# EasyEDA Pro project ProDoc_PCB1_5_2026-05-18.epro

# Board PCB1_5
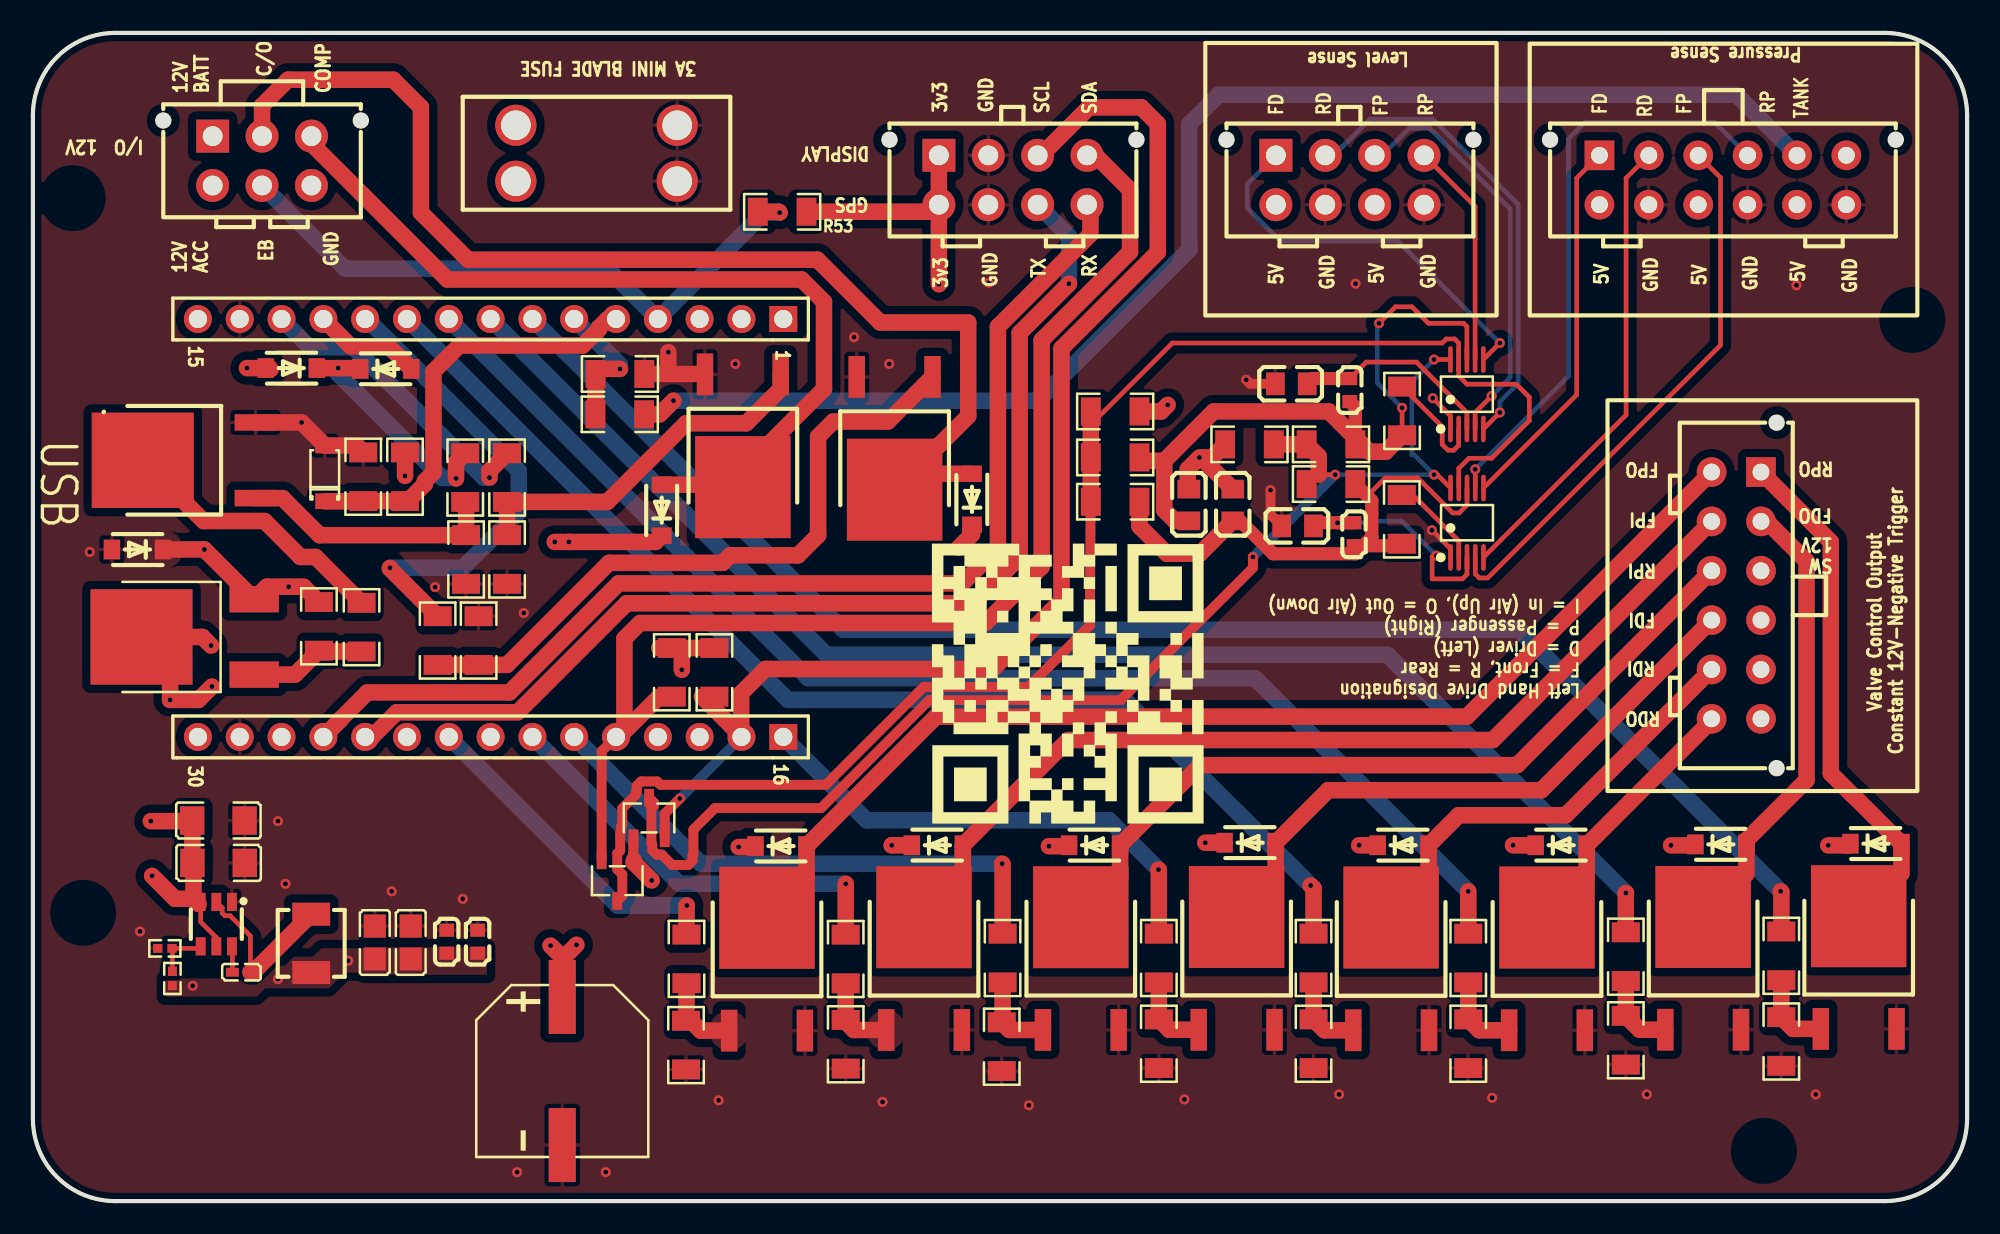
[diagram p0: board, top side]
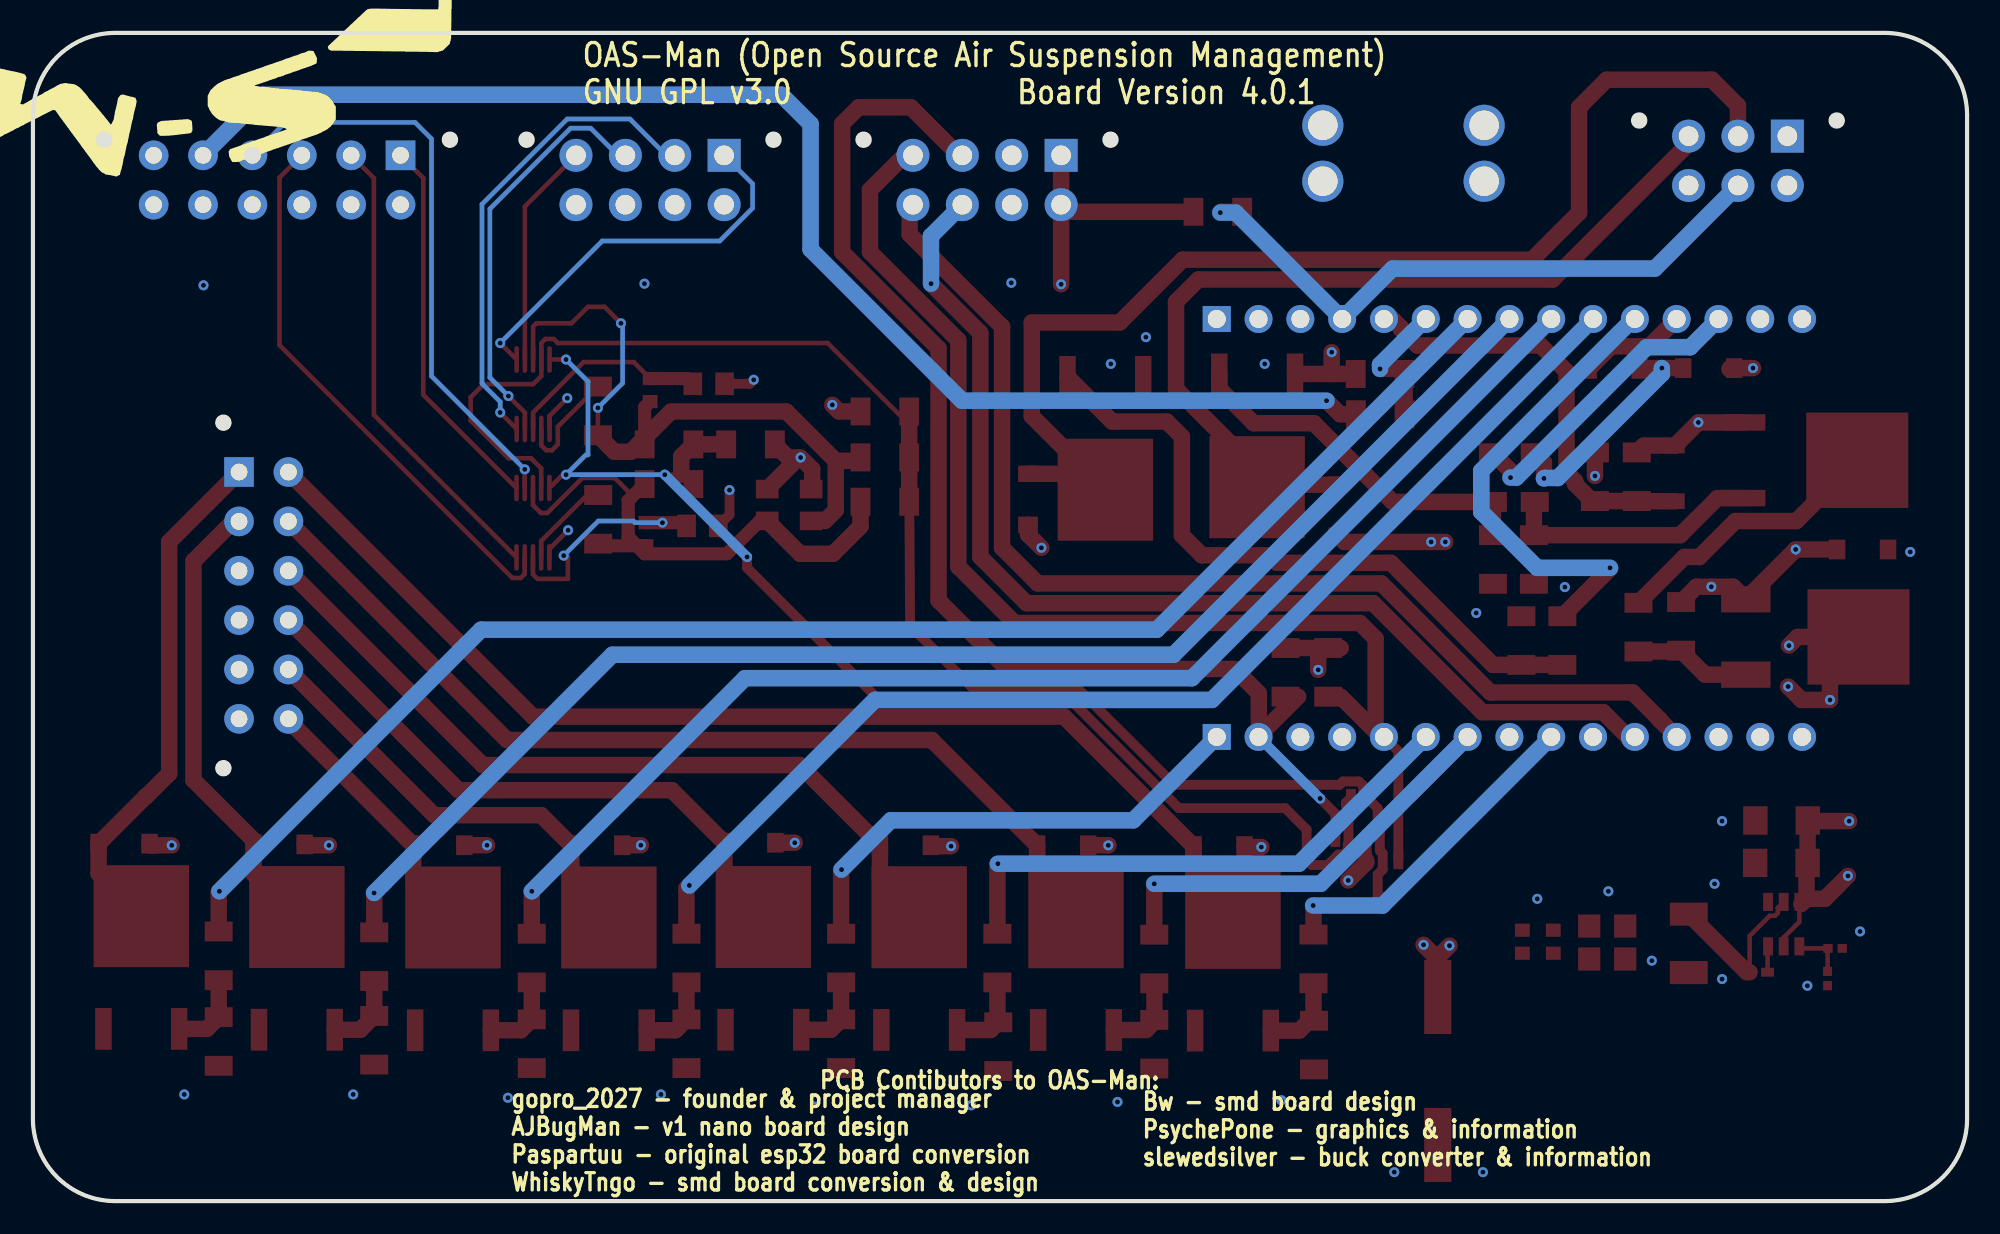
[diagram p1: board, bottom side, seen from below]

Outline 117.5 x 71 mm; copper layers: Top Layer, Inner1, Inner2, Bottom Layer. Coordinates in mm from the lower left corner of the outline.
Outline path: 0,66 0,5 arc(1.46,1.46) 5,0 112.5,0 arc(116.04,1.46) 117.5,5 117.5,66 arc(116.04,69.54) 112.5,71 5,71 arc(1.46,69.54) 0,66
Stack: Top Layer 0.035mm Outer layer thickness 1oz / Dielectric1 0.2104mm 7628 RC49% 8.6mil / Inner1 0.0152mm Inner layer thickness / Dielectric2 1.065mm 1.1mm H/HOZ Copper / Inner2 0.0152mm Inner layer thickness / Dielectric3 0.2104mm 7628 RC49% 8.6mil / Bottom Layer 0.035mm Outer layer thickness 1oz

## Design rules (mm)
template: Custom Config
spacing copperThickness1oz: track to track 0.102, other pairs 0.152 to 0.3
spacing copperThickness2oz (default): track to track 0.203, other pairs 0.152 to 0.3
track width copperThickness1oz (default): min 0.127, default 1, max 2.54
track width copperThickness2oz: min 0.203, default 0.254, max 2.54
differential pair differentialPair (default): width min 0.127, default 0.254, max 2.54; gap min 0.152, default 0.152
via viaSize (default): diameter min 0.5, default 0.61, max 10; hole min 0.3, default 0.305, max 6.3
net $1N33547 uses Fullfill
pour e746 uses Fullfill
pour e1012 uses Fullfill

## Placement (name value [footprint] x y rotation side)
C1  1uF  [C0603]  80 49.29 90 top
C2  1uF  [C0603]  80.26 40.53 90 top
C5  1uF  [C0603]  25.14 15.77 270 top
C6  1uF  [C0603]  27.02 15.77 270 top
C12  100nF  [C0402]  12.67 13.91 0 top
C13  22uF  [C0805]  22.95 15.71 270 top
C14  22uF  [C0805]  20.77 15.71 270 top
C15  10uF  [C1206]  11.27 23.13 180 top
C16  10uF  [C1206]  11.28 20.55 180 top
C17  1000uF  [CAP-SMD_BD10.0-L10.3-W10.3-FD]  32.16 7.91 270 top
CN2  HC-MX3.0-2*6A  [CONN-TH_12P-P3.00_HC-MX3.0-2X6A]  103.48 36.81 270 top
CN3  HC-MX3.0-2*6A  [CONN-TH_12P-P3.00_HC-MX3.0-2X6A]  102.67 62.06 0 top
CN4  HC-MX3.0-2*4A  [CONN-TH_8P-P3.00_HC-MX3.0-2X4A]  80.01 62.06 0 top
CN5  HC-MX3.0-2*4A  [CONN-TH_8P-P3.00_HC-MX3.0-2X4A]  59.54 62.06 0 top
CN7  HC-MX3.0-2*3A  [CONN-TH_6P-P3.00_HC-MX3.0-2X3A]  13.92 63.23 0 top
D1  SM4007PL  [SOD-123F_L2.8-W1.8-LS3.7-RD]  54.94 21.63 0 top
D2  SM4007PL  [SOD-123F_L2.8-W1.8-LS3.7-RD]  45.44 21.58 0 top
D3  SM4007PL  [SOD-123F_L2.8-W1.8-LS3.7-RD]  73.94 21.78 0 top
D4  SM4007PL  [SOD-123F_L2.8-W1.8-LS3.7-RD]  102.54 21.68 0 top
D5  SM4007PL  [SOD-123F_L2.8-W1.8-LS3.7-RD]  92.84 21.63 0 top
D6  SM4007PL  [SOD-123F_L2.8-W1.8-LS3.7-RD]  83.24 21.63 0 top
D7  SM4007PL  [SOD-123F_L2.8-W1.8-LS3.7-RD]  111.96 21.72 0 top
D8  SM4007PL  [SOD-123F_L2.8-W1.8-LS3.7-RD]  64.5 21.63 0 top
D9  SM4007PL  [SOD-123F_L2.8-W1.8-LS3.7-RD]  38.2 41.99 90 top
D10  SM4007PL  [SOD-123F_L2.8-W1.8-LS3.7-RD]  6.35 39.61 180 top
D15  SM4007PL  [SOD-123F_L2.8-W1.8-LS3.7-RD]  15.7 50.63 180 top
D16  SM4007PL  [SOD-123F_L2.8-W1.8-LS3.7-RD]  21.44 50.58 0 top
D17  SM4007PL  [SOD-123F_L2.8-W1.8-LS3.7-RD]  57.05 42.65 90 top
F2  XF-508P-B-B  [FUSE-TH_4P-L16.0-W6.7]  34.24 63.68 0 top
L3  3.3uH  [IND-SMD_L4.5-W4.1_SL0420]  16.91 15.66 270 top
Q1  MDT30N06L  [TO-252-2_L6.6-W5.6-P4.60-LS9.7-BR]  54.13 13.83 270 top
Q2  MDT30N06L  [TO-252-2_L6.6-W5.6-P4.60-LS9.7-BR]  44.6 13.79 270 top
Q3  MDT30N06L  [TO-252-2_L6.6-W5.6-P4.60-LS9.7-BR]  73.12 13.84 270 top
Q4  MDT30N06L  [TO-252-2_L6.6-W5.6-P4.60-LS9.7-BR]  101.47 13.84 270 top
Q5  MDT30N06L  [TO-252-2_L6.6-W5.6-P4.60-LS9.7-BR]  91.98 13.81 270 top
Q6  MDT30N06L  [TO-252-2_L6.6-W5.6-P4.60-LS9.7-BR]  82.51 13.81 270 top
Q7  MDT30N06L  [TO-252-2_L6.6-W5.6-P4.60-LS9.7-BR]  110.91 13.89 270 top
Q8  MDT30N06L  [TO-252-2_L6.6-W5.6-P4.60-LS9.7-BR]  63.66 13.83 270 top
Q9  MDT30N06L  [TO-252-2_L6.6-W5.6-P4.60-LS9.7-BR]  43.13 46.82 90 top
Q12  BSS138  [SOT-23-3_L2.9-W1.6-P1.90-LS2.8-BR]  35.5 19.47 90 top
Q13  BSS138  [SOT-23-3_L2.9-W1.6-P1.90-LS2.8-BR]  37.43 23.28 270 top
Q14  MDT30N06L  [TO-252-2_L6.6-W5.6-P4.60-LS9.7-BR]  10.1 45.03 0 top
Q15  MDT35P10D  [TO-252-2_L6.6-W6.1-P4.57-LS9.9-BR-CW]  10.02 34.29 0 top
Q16  MDT30N06L  [TO-252-2_L6.6-W5.6-P4.60-LS9.7-BR]  52.35 46.66 90 top
R1  10kΩ  [R1206]  49.38 9.53 270 top
R2  10kΩ  [R1206]  39.68 9.48 270 top
R3  10kΩ  [R1206]  68.4 9.56 270 top
R4  10kΩ  [R1206]  96.77 9.78 270 top
R5  10kΩ  [R1206]  87.2 9.56 270 top
R6  10kΩ  [R1206]  77.8 9.56 270 top
R7  10kΩ  [R1206]  106.22 9.7 270 top
R8  10kΩ  [R1206]  58.86 9.39 270 top
R9  150Ω  [R1206]  49.38 14.71 90 top
R10  150Ω  [R1206]  39.7 14.72 90 top
R11  150Ω  [R1206]  68.4 14.77 90 top
R12  150Ω  [R1206]  96.77 14.86 90 top
R13  150Ω  [R1206]  87.2 14.77 90 top
R14  150Ω  [R1206]  77.8 14.77 90 top
R15  150Ω  [R1206]  106.22 14.91 90 top
R16  150Ω  [R1206]  58.91 14.77 90 top
R17  150Ω  [R1206]  28.8 43.97 90 top
R18  10kΩ  [R1206]  28.8 39 270 top
R19  1kΩ  [R1206]  35.65 47.82 0 top
R23  10kΩ  [R1206]  22.61 44.03 90 top
R24  2kΩ  [R1206]  35.66 50.27 180 top
R25  10kΩ  [R1206]  20.07 44.03 270 top
R27  10kΩ  [R1206]  65.75 47.99 180 top
R28  10kΩ  [R1206]  41.4 32.14 90 top
R29  10kΩ  [R1206]  73.91 45.99 180 top
R30  10kΩ  [R1206]  38.81 32.14 90 top
R33  1MΩ  [R1206]  78.86 45.99 180 top
R37  10kΩ  [R1206]  26.31 39 270 top
R38  150Ω  [R1206]  26.26 43.97 90 top
R39  10kΩ  [R1206]  17.37 34.93 270 top
R40  3kΩ  [R1206]  19.96 34.88 270 top
R41  1MΩ  [R1206]  83.18 48.02 90 top
R42  1MΩ  [R1206]  65.75 45.2 180 top
R43  1MΩ  [R1206]  83.16 41.43 90 top
R44  1MΩ  [R1206]  65.75 42.51 0 top
R45  1MΩ  [R1206]  78.86 43.58 0 top
R50  56.2kΩ  [R0402]  8.47 13.53 270 top
R51  10kΩ  [R0402]  8.02 15.36 0 top
R53  10kΩ  [R1206]  45.52 60.13 180 top
R54  10kΩ  [R1206]  27.08 34.07 90 top
R55  150Ω  [R1206]  24.59 34.07 90 top
U4  ADS1115IDGSR  [MSOP-10_L3.0-W3.0-P0.50-LS5.0-BL]  87.11 49.04 0 top
U5  ADS1115IDGSR  [MSOP-10_L3.0-W3.0-P0.50-LS5.0-BL]  87.12 41.23 0 top
U7  PM2.54-1*15  [HDR-TH_15P-P2.54-V-F]  27.8 53.61 180 top
U8  PM2.54-1*15  [HDR-TH_15P-P2.54-V-F]  27.8 28.21 180 top
U9  GZ2012D152TF  [L0805]  70.22 42.31 270 top
U10  GZ2012D152TF  [L0805]  76.45 49.67 0 top
U11  GZ2012D152TF  [L0805]  72.89 42.31 270 top
U12  GZ2012D152TF  [L0805]  76.83 41.04 0 top
U13  TPS563200DDCR  [SOT-23-6_L2.9-W1.6-P0.95-LS2.8-BR]  11.14 16.83 90 top
ZD1  MMSZ4684  [SOD-123_L2.8-W1.8-LS3.7-RD]  17.73 44.23 90 top

## Footprints (pads in the part's own frame, mm; a bottom-side part is the same pattern mirrored in y, then rotated)
C0402
  rect 0.79x0.54 smd: 1(-0.545,0) 2(0.545,0)
C0603
  rect 0.8x0.9 smd: 1(-0.7,0) 2(0.7,0)
C0805
  rect 1.41x1.35 smd: 1(-1,0) 2(1,0)
C1206
  rect 1.485x1.728 smd: 1(-1.593,0) 2(1.593,0)
CAP-SMD_BD10.0-L10.3-W10.3-FD
  rect 4.5x1.65 smd: 1(-4.5,0) 2(4.5,0)
CONN-TH_6P-P3.00_HC-MX3.0-2X3A
  rect 2x2 hole 1.2: 1(-3,1.5)
  round 2 hole 1.2: 2(-3,-1.5) 3(0,1.5) 4(0,-1.5) 5(3,1.5) 6(3,-1.5)
CONN-TH_8P-P3.00_HC-MX3.0-2X4A
  rect 2x2 hole 1.2: 1(-4.5,1.5)
  round 2 hole 1.2: 2(-4.5,-1.5) 3(-1.5,1.5) 4(-1.5,-1.5) 5(1.5,1.5) 6(1.5,-1.5) 7(4.5,1.5) 8(4.5,-1.5)
CONN-TH_12P-P3.00_HC-MX3.0-2X6A
  rect 1.8x1.8 hole 1.02: 1(-7.5,1.5)
  round 1.8 hole 1.02: 2(-7.5,-1.5) 3(-4.5,1.5) 4(-4.5,-1.5) 5(-1.5,1.5) 6(-1.5,-1.5) 7(1.5,1.5) 8(1.5,-1.5) 9(4.5,1.5) 10(4.5,-1.5) 11(7.5,1.5) 12(7.5,-1.5)
FUSE-TH_4P-L16.0-W6.7
  round 2.5 hole 1.8: 1(-4.9,1.7) 2(4.9,1.7) 3(4.9,-1.7) 4(-4.9,-1.7)
HDR-TH_15P-P2.54-V-F
  rect 1.7x1.575 hole 1.1: 1(-17.78,0)
  round 1.7 hole 1.1: 2(-15.24,0) 3(-12.7,0) 4(-10.16,0) 5(-7.62,0) 6(-5.08,0) 7(-2.54,0) 8(0,0) 9(2.54,0) 10(5.08,0) 11(7.62,0) 12(10.16,0) 13(12.7,0) 14(15.24,0) 15(17.78,0)
IND-SMD_L4.5-W4.1_SL0420
  rect 1.4x2.3 smd: 1(-1.775,0) 2(1.775,0)
L0805
  rect 1.133x1.377 smd: 1(-0.966,0) 2(0.966,0)
MSOP-10_L3.0-W3.0-P0.50-LS5.0-BL
  oval 0.28x1.62 smd: 1(-1,-2.11) 2(-0.5,-2.11) 3(0,-2.11) 4(0.5,-2.11) 5(1,-2.11) 6(1,2.11) 7(0.5,2.11) 8(0,2.11) 9(-0.5,2.11) 10(-1,2.11)
R0402
  rect 0.566x0.54 smd: 1(-0.433,0) 2(0.433,0)
R1206
  rect 1.208x1.701 smd: 1(-1.479,0) 2(1.479,0)
SOD-123_L2.8-W1.8-LS3.7-RD
  rect 0.95x1.15 smd: 1(-1.692,0) 2(1.692,0)
SOD-123F_L2.8-W1.8-LS3.7-RD
  rect 1x1.2 smd: 1(-1.55,0) 2(1.55,0)
SOT-23-3_L2.9-W1.6-P1.90-LS2.8-BR
  rect 1.07x0.6 smd: 1(1.235,-0.95) 2(1.235,0.95) 3(-1.235,0)
SOT-23-6_L2.9-W1.6-P0.95-LS2.8-BR
  rect 1.1x0.6 smd: 1(1.35,-0.95) 2(1.35,0) 3(1.35,0.95) 4(-1.35,0.95) 5(-1.35,0) 6(-1.35,-0.95)
TO-252-2_L6.6-W5.6-P4.60-LS9.7-BR
  rect 2.54x1 smd: 1(3.426,-2.3) 3(3.426,2.3)
  rect 6.2x5.8 smd: 2(-3.426,0)
TO-252-2_L6.6-W6.1-P4.57-LS9.9-BR-CW
  rect 3x1.6 smd: 1(3.424,-2.29) 3(3.424,2.29)
  rect 6.2x5.8 smd: 2(-3.424,0)

## Nets
3.3V: CN5.1 CN5.2 Q12.1 Q13.1 R28.2 R30.2 R53.1 U8.15
12VACC: CN7.2 D15.2 R23.2
12VS: C15.2 C16.2 CN2.5 Q15.2 U13.3 U13.5
+5V: C5.2 C6.2 C13.2 C14.2 CN3.2 CN3.6 CN3.10 CN4.2 CN4.6 L3.2 R27.1 R29.2 R50.2 U4.1 U7.15 U9.1 U11.1
GND: C5.1 C6.1 C13.1 C14.1 C15.1 C16.1 C17.2 CN3.4 CN3.8 CN3.12 CN4.4 CN4.8 CN5.3 CN5.4 D10.2 F2.2 F2.3 Q1.3 Q2.3 Q3.3 Q4.3 Q5.3 Q6.3 Q7.3 Q8.3 Q9.3 Q14.3 Q16.3 R1.2 R2.2 R3.2 R4.2 R5.2 R6.2 R7.2 R8.2 R18.2 R24.1 R25.1 R37.2 R51.1 R54.2 U5.1 U7.14 U8.14 U10.1 U12.1 U13.1 ZD1.2
VCC: C17.1 CN7.1 D1.1 D2.1 D3.1 D4.1 D5.1 D6.1 D7.1 D8.1 D9.1 D10.1 D17.1 Q15.3 R39.1
ACC_SENSE: R23.1 R25.2 U7.5 ZD1.1
ADS/LLC_1: Q13.3 R29.1 R33.2 R45.1 U4.10 U5.10
ADS/LLC_2: Q12.3 R27.2 R42.2 R44.1 U4.9 U5.9
COMP_OUTPUT: CN7.5 D9.2 Q9.2
COMP_OUTPUT_TRIGGER: R17.2 U7.13
CUSTOM_OUTPUT: CN7.3 D17.2 Q16.2
CUSTOM_OUTPUT_TRIGGER: R55.2 U7.11
E-BRAKE: CN7.4 R53.2 U7.4
FD_LEVEL2: CN4.1 U4.6
FD_PRESS1: CN3.1 U5.6
FDI: CN2.8 D3.2 Q3.2
FDI_TRIGGER: R11.2 U8.1
FDO: CN2.3 D4.2 Q4.2
FDO_TRIGGER: R12.2 U7.8
FP_LEVEL2: CN4.5 U4.4
FP_PRESS1: CN3.5 U5.4
FPI: CN2.4 D1.2 Q1.2
FPI_TRIGGER: R9.2 U8.7
FPO: CN2.2 D2.2 Q2.2
FPO_TRIGGER: R10.2 U8.9
KEEP_ALIVE: D16.2 U7.12
RD_LEVEL2: CN4.3 U4.5
RD_PRESS1: CN3.3 U5.5
RDI: CN2.10 D6.2 Q6.2
RDI_TRIGGER: R14.2 U7.10
RDO: CN2.12 D5.2 Q5.2
RDO_TRIGGER: R13.2 U7.9
RP_LEVEL2: CN4.7 U4.7
RP_PRESS1: CN3.7 U5.7
RPI: CN2.6 D8.2 Q8.2
RPI_TRIGGER: R16.2 U8.6
RPO: CN2.1 D7.2 Q7.2
RPO_TRIGGER: R15.2 U7.7
RX: CN5.8 U8.12
SCL: CN5.5 Q13.2 R28.1 U8.2
SDA: CN5.7 Q12.2 R30.1 U8.5
TANK_PRESS1: CN3.9 R19.2
TANKPRESSURESIG: R19.1 R24.2 U7.6
TX: CN5.6 U8.11
VEHICLE_GND: CN7.6 F2.1 F2.4
$1N4350: Q8.1 R8.1 R16.1
$1N4351: Q7.1 R7.1 R15.1
$1N4352: Q6.1 R6.1 R14.1
$1N4353: Q5.1 R5.1 R13.1
$1N4354: Q4.1 R4.1 R12.1
$1N4355: Q3.1 R3.1 R11.1
$1N4356: Q2.1 R2.1 R10.1
$1N4357: Q1.1 R1.1 R9.1
$1N4376: Q9.1 R17.1 R18.1
$1N4402: C2.1 R43.1 R44.2 R45.2 U5.8 U11.2
$1N4419: C1.1 R33.1 R41.1 R42.1 U4.8 U9.2
$1N4475: Q14.2 R40.1
$1N4476: Q15.1 R39.2 R40.2
$1N4478: Q14.1 R37.1 R38.1
$1N12707: C1.2 U4.3 U10.2
$1N12784: R41.2 U4.2
$1N13030: C2.2 U5.3 U12.2
$1N13089: R43.2 U5.2
$1N23795: D15.1 D16.1 R38.2
$1N33541: C12.1 U13.6
$1N33542: C12.2 L3.1 U13.2
$1N33547: R50.1 R51.2 U13.4
$1N131280: Q16.1 R54.1 R55.1

Pads without a net: CN2 7 9 11; CN3 11; U7 1 2 3; U8 3 4 8 10 13

## Via types
v1: diameter 0.61, hole 0.305, Top Layer to Bottom Layer, 89 vias

## Routing (per net, layer and track width the routed paths; a pad name or vN(x,y) marks a point on that pad's centre or on a via; arc(x,y) is an arc through that point)
3.3V: length 111.7
  Top Layer w0.6: 36.48,20.74 Q12.1 ; Q13.1 36.48,20.74
  Top Layer w1: v1(39.42,32.29) 39.42,33.55 39.36,33.62 ; CN5.1 CN5.2 ; CN5.2 v1(55.04,55.72) ; CN5.2 54.61,60.13 R53.1 ; 39.36,33.62 38.05,33.62 ; 39.36,33.62 40.64,33.62 ; v1(37.59,19.49) 36.5,20.58 36.5,20.71
  Inner2 w1: v1(39.42,32.29) 37.54,30.41 12.22,30.41 U8.15 ; v1(39.42,32.29) 55.04,47.91 v1(55.04,55.72) ; v1(39.42,32.29) 40.23,31.48 46.94,31.48 48.77,29.65 48.77,26.5 45.67,23.4 41.5,23.4 v1(37.59,19.49)
12VACC: length 34.1
  Top Layer w1: v1(13,50.63) 14.38,50.63 14.44,50.56 ; v1(22.61,44.08) R23.2
  Inner1 w1: CN7.2 7.47,58.28 7.47,52.25 9.09,50.63 v1(13,50.63) 14.94,48.7 21.03,48.7 22.61,47.12 v1(22.61,44.08)
12VS: length 25.8
  Top Layer w0.28: U13.3 10.19,16.97 11.14,16.02 U13.5
  Top Layer w1: v1(7.16,23.09) 9.64,23.09 C15.2 9.69,23.12 C16.2 9.75,20.49 9.75,18.37 ; 9.75,18.37 10.07,18.06 ; 9.75,18.37 8.64,18.37 v1(7.24,19.77) ; v1(10.87,31.27) 10.06,30.46 v1(8.33,30.46) 8.33,32.55 Q15.2 10.3,34.29 v1(10.82,33.76)
+5V: length 227.2
  Top Layer w0.28: U4.1 86.11,47.72 v1(85.04,48.8)
  Top Layer w1: v1(70.87,45.19) 70.16,44.49 70.16,43.34 U9.1 ; 67.22,47.99 68.53,47.99 v1(68.94,48.39) ; U11.1 70.97,45.19 71.63,45.19 R29.2
  Inner2 w0.6: v1(85.04,48.8) 84.53,49.31 83.09,49.31 74.55,57.84
  Inner2 w1: v1(9.7,13.09) 8.29,14.5 8.29,20.29 ; CN3.10 104.91,58.3 103.43,58.3 CN3.6 99.01,58.4 97.32,58.4 CN3.2 ; 13.97,14.61 13.97,14.41 v1(14.88,13.49) ; 13.97,14.61 v1(19.15,14.61) ; 13.97,14.61 8.29,20.29 ; CN4.6 79.14,58.19 77.88,58.19 CN4.2 ; 8.29,20.29 1.88,26.7 1.88,50.58 4.91,53.61 U7.15
  Inner2 w1.5: 59.43,57.84 14.25,57.84 U7.15 ; 59.43,57.84 59.43,57.57 68.6,48.39 v1(68.94,48.39) 70.87,46.46 v1(70.87,45.19) ; 59.43,57.84 104.24,57.84
GND: length 62.1
  Top Layer w0.28: v1(84.99,40.77) 86.12,39.64 U5.1
  Top Layer w0.6: v1(73.71,49.92) 73.95,49.67 U10.1 ; v1(75.18,43.21) 75.18,41.72 U12.1
  Top Layer w1: Q14.3 v1(16.32,47.33) ZD1.2 19.65,45.92 R25.1 ; 38.6,50.27 40.74,50.27 40.77,50.25 40.83,50.25 ; 38.6,50.27 R24.1 ; 38.6,50.27 v1(38.6,51.59)
  Inner1 w1: v1(58.06,55.81) 58.04,55.84 CN5.4 CN5.3 ; CN4.8 84.51,59.92 v1(80.35,55.76) 80.16,55.76 78.51,57.41 CN4.4 ; CN3.8 104.17,58.63 ; 104.17,58.63 104.17,58.19 101.84,55.86 100.84,55.86 98.17,58.53 CN3.4 ; 104.17,58.63 v1(107.14,55.66) 108.14,55.66 110.17,57.69 CN3.12
  vias: v1(3.45,39.45) v1(6.5,16.39) v1(14.88,23.09) v1(15.34,19.28) v1(21.79,18.83) v1(24.44,37.32) v1(26.11,18.37) v1(29.41,1.76) v1(29.82,35.74) v1(34.8,1.76) v1(41.66,6.13) v1(42.67,50.88) v1(49.89,52.51) v1(51.61,6.03) v1(52.02,50.88) v1(60.5,5.82) v1(69.95,6.18) v1(79.35,6.48) v1(88.65,6.28) v1(98.04,6.48) v1(108.31,6.48)
VCC: length 100.9
  Top Layer w1: 32.16,14.71 v1(33.02,15.58) ; 32.16,14.71 32.16,14.81 v1(31.44,15.53) ; 32.16,14.71 C17.1 ; v1(31.7,40.06) v1(32.56,40.06) 37.82,40.06 D9.1 ; v1(109.07,21.62) 110.31,21.62 110.41,21.72 ; D4.1 100.94,21.62 v1(99.52,21.62) ; v1(42.88,21.52) 43.84,21.52 43.9,21.58 ; D5.1 v1(89.92,21.63) ; D3.1 v1(71.22,21.78) ; 53.4,21.63 52.18,21.63 v1(52.17,21.62) ; v1(56.24,39.71) 57.05,40.52 D17.1 ; D8.1 62.89,21.57 v1(61.72,21.57) ; D10.1 v1(10.41,39.61) 13.44,36.58 14.2,37.34 v1(15.54,37.34) 16.44,37.34 R39.1 ; D6.1 v1(80.57,21.63)
  Inner1 w1: v1(109.07,21.62) v1(99.52,21.62) 99.51,21.63 v1(89.92,21.63) v1(80.57,21.63) 80.42,21.78 v1(71.22,21.78) 71.01,21.57 v1(61.72,21.57) 61.67,21.62 v1(52.17,21.62) 52.07,21.52 v1(42.88,21.52)
ACC_SENSE: length 26
  Top Layer w1: U7.5 34.92,53.61 34.39,53.08 34.39,52.99 33.4,52 25.91,52 24.33,50.43 24.33,44.28 23.81,43.75 23.81,43.58 22.78,42.55 22.61,42.55 R23.1 R25.2 20.06,42.54 ZD1.1
ADS/LLC_1: length 79.2
  Top Layer w0.28: R45.1 77.95,44.15 v1(79.11,44.15) ; v1(85.11,44.15) 85.31,44.15 U5.10 ; U4.10 v1(85.11,51.15)
  Top Layer w0.6: v1(74.11,39.15) 74.11,38.48 66.08,30.45 54.45,30.45 47.88,23.88 41.43,23.88 40.12,22.58 40.12,21.08 40.07,21.03 40.07,20.69 39.81,20.43 38.83,20.43 38.2,21.06 37.89,21.06 37.63,21.33 37.63,21.67 37.58,21.72 37.58,23.88 37.73,24.04 37.73,24.21 Q13.3
  Top Layer w1: 78.11,44.15 78.11,45.26 R33.2 75.38,45.99
  Bottom Layer w0.28: v1(79.11,44.15) v1(85.11,44.15) 83.91,45.35 83.78,45.35 83.78,49.81 v1(85.11,51.15)
  Bottom Layer w0.6: v1(79.11,44.15) v1(74.11,39.15)
ADS/LLC_2: length 93.8
  Top Layer w0.28: 64.27,47.2 69.22,52.15 85.61,52.15 85.86,52.4 86.36,52.4 86.61,52.15 U4.9 86.61,50.15 87.11,49.65 90.11,49.65 90.91,48.86 90.91,47.44 88.61,45.15 87.24,45.15 86.62,44.53 U5.9
  Top Layer w0.6: 64.27,44.28 64.21,34.98 60.48,31.25 54.11,31.25 48.17,25.3 38.12,25.3 37.92,25.51 36.94,25.51 36.68,25.24 36.68,24.9 36.63,24.85 36.63,24.69 35.8,23.87 35.8,22.85 35.73,22.77 35.73,22.43 35.68,22.38 35.68,21.3 35.5,21.12 35.5,20.16 35.8,19.86 35.8,18.54 Q12.3
  Top Layer w1: R27.2 R42.2 R44.1
COMP_OUTPUT: length 53.9
  Top Layer w1: D9.2 42.98,43.54 Q9.2 43.13,44.43 48.06,49.36 48.06,54.66 46.7,56.01 25.18,56.01 16.92,64.27 CN7.5
COMP_OUTPUT_TRIGGER: length 18.5
  Top Layer w1: R17.2 27.74,44.39 v1(27.74,43.97)
  Bottom Layer w1: v1(27.74,43.97) 27.38,43.97 19.46,51.9 16.82,51.9 U7.13
CUSTOM_OUTPUT: length 71
  Top Layer w1: D17.2 53.31,44.2 ; 53.31,44.2 56.82,47.71 56.82,53.4 51.47,53.4 47.66,57.22 26.43,57.22 23.57,60.08 23.57,66.48 21.89,68.16 15.49,68.16 13.92,66.58 CN7.3 ; 53.31,44.2 Q16.2
CUSTOM_OUTPUT_TRIGGER: length 29
  Top Layer w1: v1(21.69,38.49) 21.69,38.44 R55.2
  Bottom Layer w1: U7.11 20.28,53.61 29.52,44.38 29.52,41.89 26.11,38.49 v1(21.69,38.49)
E-BRAKE: length 38.8
  Top Layer w1: v1(45.36,60.08) 45.31,60.13 R53.2
  Bottom Layer w1: v1(45.36,60.08) 44.43,60.08 U7.4 34.9,56.67 18.97,56.67 CN7.4
FD_LEVEL2: length 24.1
  Top Layer w0.28: U4.6 v1(89.11,52.15)
  Bottom Layer w0.28: v1(89.11,52.15) 82.91,58.35 75.78,58.35 73.78,60.35 73.78,61.83 CN4.1
FD_PRESS1: length 23.1
  Top Layer w0.28: CN3.1 93.78,62.18 93.78,49 U5.6
FDI: length 37.6
  Top Layer w1: Q3.2 75.49,19.63 D3.2 78.69,24.97 91.64,24.97 CN2.8
FDI_TRIGGER: length 30
  Top Layer w1: v1(68.38,20.15) 68.4,20.13 R11.2
  Bottom Layer w1: v1(68.38,20.15) 65.38,23.15 50.65,23.15 U8.1
FDO: length 28
  Top Layer w1: CN2.3 105.33,41.31 107.75,38.89 107.75,25.58 104.09,21.93 D4.2 104.09,19.9 Q4.2
FDO_TRIGGER: length 85.8
  Top Layer w1: v1(96.77,18.73) 96.77,18.72 96.77,16.33
  Bottom Layer w1: v1(96.77,18.73) 82.3,33.2 48.21,33.2 U7.8
FP_LEVEL2: length 25.2
  Top Layer w0.28: v1(88.61,48.93) 87.61,47.93 U4.4
  Bottom Layer w0.28: CN4.5 81.97,63.56 83.62,65.21 84.84,65.21 89.74,60.31 89.74,50.05 v1(88.61,48.93)
FP_PRESS1: length 34
  Top Layer w0.28: CN3.5 102.52,62.21 102.52,52.02 88.37,37.87 87.87,37.87 87.62,38.12 U5.4
FPI: length 59
  Top Layer w1: Q1.2 56.49,19.61 D1.2 62.89,28.02 88.69,28.02 CN2.4
FPI_TRIGGER: length 25.8
  Top Layer w1: R9.2 v1(49.38,19.28)
  Bottom Layer w1: U8.7 39.27,19.28 v1(49.38,19.28)
FPO: length 69.8
  Top Layer w1: Q2.2 47,19.61 D2.2 54.86,29.44 87.11,29.44 CN2.2
FPO_TRIGGER: length 20.5
  Top Layer w1: v1(39.73,17.96) 39.7,17.94 R10.2
  Bottom Layer w1: U8.9 35.51,17.96 v1(39.73,17.96)
KEEP_ALIVE: length 6.6
  Top Layer w1: D16.2 21.62,51.95 19.31,51.95 U7.12
RD_LEVEL2: length 29.3
  Top Layer w0.28: U4.5 v1(89.11,47.93)
  Bottom Layer w0.28: CN4.3 79.02,63.56 81.23,65.77 85.04,65.77 90.22,60.59 90.22,49.69 89.11,48.58 v1(89.11,47.93)
RD_PRESS1: length 28.6
  Top Layer w0.28: U5.5 96.78,47.78 96.78,62.18 CN3.3
RDI: length 27
  Top Layer w1: Q6.2 84.79,19.51 D6.2 86.61,23.45 93.12,23.45 CN2.10
RDI_TRIGGER: length 72.2
  Top Layer w1: v1(77.62,19.18) 77.8,19.01 R14.2
  Bottom Layer w1: v1(77.62,19.18) 66.34,30.46 45.87,30.46 U7.10
RDO: length 16.2
  Top Layer w1: CN2.12 101.98,29.22 D5.2 94.39,19.65 Q5.2
RDO_TRIGGER: length 78.9
  Top Layer w1: R13.2 v1(87.2,18.83)
  Bottom Layer w1: v1(87.2,18.83) 74.24,31.78 47.09,31.78 U7.9
RP_LEVEL2: length 13.7
  Top Layer w0.28: CN4.7 87.61,60.45 U4.7
RP_PRESS1: length 35.7
  Top Layer w0.28: U5.7 v1(87.62,44.47)
  Bottom Layer w0.28: v1(87.62,44.47) 93.29,50.14 93.29,64.56 94.29,65.56 102.17,65.56 CN3.7
RPI: length 48.2
  Top Layer w1: CN2.6 90.17,26.5 70.92,26.5 66.04,21.63 66.04,19.64 Q8.2
RPI_TRIGGER: length 33.5
  Top Layer w1: v1(58.88,20.5) 58.91,20.47 58.91,16.25
  Bottom Layer w1: U8.6 40.59,20.5 v1(58.88,20.5)
RPO: length 31.6
  Top Layer w1: CN2.1 109.22,40.07 109.22,25.99 110.59,24.62 110.62,24.62 D7.2 113.51,19.92 110.91,17.32
RPO_TRIGGER: length 92.7
  Top Layer w1: R15.2 106.22,18.78 v1(106.17,18.83)
  Bottom Layer w1: U7.7 49.23,34.73 90.27,34.73 v1(106.17,18.83)
RX: length 69
  Top Layer w1: CN5.8 64.24,60.36 64.24,58.76 58.62,53.14 58.62,39.71 56.46,37.54 35.58,37.54 28.95,30.92 20.32,30.92 18.68,29.28 18.68,29.25 U8.12
SCL: length 76.3
  Top Layer w0.6: v1(39.3,24.47) 38.38,23.55 Q13.2
  Top Layer w1: U8.2 43.04,28.26 43.03,28.27 ; CN5.5 61.09,63.56 61.14,63.51 61.19,63.51 64.16,66.47 67.34,66.47 68.34,65.47 68.34,57.68 62.48,51.82 62.48,36.51 58.32,32.34 44.5,32.34 43.03,30.87 43.03,28.27 ; 40.64,30.66 43.03,28.27
  Bottom Layer w0.6: v1(39.3,24.47) U8.2
SDA: length 73.4
  Top Layer w0.6: Q12.2 34.55,27.34 U8.5
  Top Layer w1: CN5.7 64.55,63.56 66.65,61.45 66.65,57.69 61.28,52.32 61.28,38.55 57.86,35.14 36.88,35.14 35.93,34.19 35.93,28.67 35.47,28.21 ; 35.47,28.21 U8.5 ; 35.47,28.21 35.6,28.21 38.05,30.66
TANK_PRESS1: length 84.1
  Top Layer w1: R19.2 38.09,47.82 v1(38.91,48.65)
  Bottom Layer w1: CN3.9 103.49,67.24 72.03,67.24 70.26,65.46 70.26,57.84 61.06,48.65 v1(38.91,48.65)
TANKPRESSURESIG: length 8.2
  Top Layer w1: 34.17,47.82 34.17,50.26 34.49,50.58 v1(35.66,50.58)
  Bottom Layer w1: v1(35.66,50.58) 35.66,50.83 U7.6
TX: length 67.7
  Top Layer w1: v1(62.94,55.76) 59.94,52.76 59.94,39.15 57.13,36.34 36.08,36.34 29.45,29.71 22.1,29.71 20.6,28.21 U8.11
  Bottom Layer w1: CN5.6 62.94,58.66 v1(62.94,55.76)
VEHICLE_GND: length 15.9
  Inner2 w1: F2.1 F2.4 17.18,61.98 CN7.6
$1N4350: length 5.1
  Top Layer w1: 61.36,10.4 59.32,10.4 R8.1 58.91,10.92 R16.1
$1N4351: length 4.9
  Top Layer w1: Q7.1 106.93,10.46 R7.1 R15.1
$1N4352: length 4.9
  Top Layer w1: Q6.1 78.46,10.38 R6.1 77.8,13.29
$1N4353: length 5
  Top Layer w1: 87.2,13.29 R5.1 87.86,10.38 Q5.1
$1N4354: length 4.9
  Top Layer w1: Q4.1 97.61,10.41 96.77,11.25 R12.1
$1N4355: length 4.9
  Top Layer w1: Q3.1 69.03,10.41 R3.1 68.4,13.29
$1N4356: length 5
  Top Layer w1: Q2.1 40.56,10.36 39.7,11.22 R10.1
$1N4357: length 5
  Top Layer w1: Q1.1 49.87,10.4 49.37,10.9 49.37,12.83 49.38,12.84 R9.1
$1N4376: length 22.4
  Top Layer w1: Q9.1 45.43,49.37 43.33,47.28 39.68,47.28 34.89,42.5 R17.1 R18.1
$1N4402: length 34.7
  Top Layer w0.28: 81.34,41.78 81.16,41.95 ; 81.16,42.76 81.16,42.95 82.16,43.95 84.12,43.95 86.25,41.82 86.64,41.82 87.12,42.3 U5.8
  Top Layer w0.8: R45.2 81.16,42.76 81.34,42.58 81.34,40.37 ; U11.2 73.34,41.34 75.34,39.34 80.34,39.34 80.81,39.82 ; 80.81,39.82 80.82,39.83 ; 80.81,39.82 80.83,39.83 ; C2.1 80.82,39.83 ; 80.82,39.83 81.34,40.37 ; 80.83,39.83 83.03,39.83 R43.1 ; 80.83,39.83 81.34,40.34 81.34,40.37
  Top Layer w1: U11.2 70.89,39.34 68.89,39.34 67.22,41.01 67.22,42.51
$1N4419: length 42.2
  Top Layer w0.28: v1(83.18,48.21) R41.1 ; U4.8 87.11,53.15 86.91,53.35 84.78,53.35 83.78,54.35 82.78,54.35 v1(81.78,53.35)
  Top Layer w0.8: R33.1 80.34,48.26 C1.1
  Top Layer w1: R41.1 82.18,45.54 81.18,45.54 80.73,45.99 ; 68.73,44.99 71.73,47.99 78.73,47.99 80.34,46.38 80.73,45.99 ; 68.73,44.99 67.43,44.99 67.22,45.2 ; 68.73,44.99 68.73,41.99 69.38,41.34 U9.2 ; 80.73,45.99 R33.1
  Bottom Layer w0.28: 81.68,53.25 81.68,49.71 v1(83.18,48.21)
$1N4475: length 16.9
  Top Layer w1: Q14.2 10.37,41.33 14.07,41.33 16.26,39.15 17.18,39.15 R40.1
$1N4476: length 7.1
  Top Layer w1: Q15.1 15.92,32 R39.2 17.42,33.4 R40.2
$1N4478: length 15.8
  Top Layer w1: Q14.1 15.17,42.73 17.42,40.47 R37.1 26.31,42.44 R38.1
$1N12707: length 12.5
  Top Layer w0.28: U4.3 87.11,47.93 84.05,50.99 81,50.99 C1.2
  Top Layer w0.8: C1.2 77.73,49.99 U10.2
$1N12784: length 6.8
  Top Layer w0.28: R41.2 85.61,47.06 85.61,45.99 85.97,45.64 86.32,45.64 86.61,45.93 U4.2
$1N13030: length 14.4
  Top Layer w0.28: v1(85.26,39.23) 85.21,39.18 85,39.18 85,37.82 86.84,37.82 87.12,38.1 U5.3
  Top Layer w0.8: C2.2 v1(79.26,41.23) 77.99,41.23 U12.2
  Bottom Layer w0.28: v1(85.26,39.23) 83.15,41.33 81.02,41.33 80.92,41.23 v1(79.26,41.23)
$1N13089: length 5.6
  Top Layer w0.28: R43.2 83.83,42.91 86.62,40.12 U5.2
$1N23795: length 14.6
  Top Layer w1: D16.1 19.84,50.63 v1(18.54,50.63) D15.1 ; v1(25.7,43.92) 25.7,44.89 R38.2
  Bottom Layer w1: v1(25.7,43.92) 25.68,43.95 24.87,43.95 18.54,50.27 v1(18.54,50.63)
$1N33541: length 1.6
  Top Layer w0.28: U13.6 12.12,15.45 C12.1
$1N33542: length 10.5
  Top Layer w0.28: U13.2 11.5,17.82 11.5,17.51 11.67,17.34 11.98,17.34 13.21,16.11 C12.2
  Top Layer w1: C12.2 13.38,13.91 L3.1
$1N33547: length 3.2
  Top Layer w0.28: R50.1 8.47,15.33 R51.2 10.07,15.36 U13.4
$1N131280: length 40.8
  Top Layer w1: R55.1 R54.1 28.8,32.59 35,38.79 41.91,38.79 42.37,39.25 46.48,39.25 47.7,40.47 47.7,46.46 48.62,47.38 51.93,47.38 Q16.1

## Copper pours and planes (outline as drawn; the poured copper is in the pictures)
12VS on Inner1: 5.69,36.1 5.69,17.61 5.64,17.56 10.62,17.56 10.62,25.69 7.87,25.69 7.82,25.64 7.82,29.9 7.77,29.95 90.62,29.95 90.65,29.98 92.04,29.98 97.39,24.63 107.49,24.63 112.77,29.9 113.03,29.9 113.03,45.04 108.25,49.82 98.75,49.82 93.22,44.28 93.22,38.23 91.13,36.15 5.74,36.15
+5V on Top Layer: 20.77,13.89 18.94,13.89 17.98,12.94 14.12,12.94 13.61,12.43 8.03,12.43 8.03,13.53 14.01,13.53 14.78,14.31 15.3,14.31 15.86,14.86 17.01,14.86 17.53,15.37 20.77,15.37
+5V on Top Layer: 20.12,15.42 27.58,15.42 27.58,13.75 20.12,13.75
GND on Top Layer: -2.23,73.23 121.56,73.23 121.56,-2.36 -2.23,-2.36
GND on Bottom Layer: -4.47,73.49 119.74,73.49 119.74,-2.25 -4.47,-2.25
GND on Inner1: -1.63,72.73 119.38,72.73 119.38,-2 -1.63,-2
GND on Inner2: -2.9,73.18 119.18,73.18 119.18,-1.95 -2.9,-1.95
VCC on Inner1: 12.45,71.56 12.45,63.23 12.39,63.18 5.54,63.18 5.39,63.02 5.39,41.08 57.98,41.15 57.98,36.53 5.39,36.45 5.39,13.34 8.23,10.5 25.4,10.5 37.85,22.94 118.01,22.94 118.31,23.25 118.31,0.79 115.67,-1.85 -0.36,-1.85 -1.73,-0.48 -1.73,72.32 2.23,72.32 2.39,72.17 11.84,72.17

## Text on the board
Bottom Silkscreen Layer: Bw - smd board design / PsychePone - graphics & information / slewedsilver - buck converter & information | PCB Contibutors to OAS-Man: | gopro_2027 - founder & project manager / AJBugMan - v1 nano board design / Paspartuu - original esp32 board conversion / WhiskyTngo - smd board conversion & design | OAS-Man (Open Source Air Suspension Management) / GNU GPL v3.0               Board Version 4.0.1 | PCB Design Contibutors to OAS-Man: / Paspartuu - esp32 board design / AJBugMan - nano board design / gopro_2027 - nano & esp32 board design / WhiskyTngo - SMD Board Conversion / Bw - Improvements / PsychePone - information / slewedsilver - information
Top Silkscreen Layer: Left Hand Drive Designation / F = Front, R = Rear / D = Driver (Left) / P = Passenger (Right) / I = In (Air Up), O = Out (Air Down) | FD | RD | FP | RP | TANK | EB | GND | 5V | Valve Control Output / Constant 12V-Negative Trigger | 3A MINI BLADE FUSE | GPS | Level Sense | Pressure Sense | TX | RX | 15 | 30 | 16 | 1 | 12V / ACC | 12V / BATT | C/O | I/O  12V | FDI | RDI | FPI | RPI | FPO | RDO | FDO | SW / 12V | RPO | 3v3 | SCL | SDA | DISPLAY | COMP | USB
